# Altium schematic sheet LEDS.SchDoc
size A4; SheetNumber: 3; SheetTotal: 10; SPICEModelCacheAGKUTXAB: <root> / <DocumentId>AGKUTXAB</DocumentId> / <CacheFrame Number="0"> / <Model Name="0603_150060as75000" Kind="CKT"> / <Text>************************************************** / * Manufacturer:           WÃ¼rth Elektronik / * Kinds:                  SMT Mono-color Chip LED Waterclear / * Matchcode:              WL-SMCW / * Library Type:           LTspice / * Version:                rev24a / * Created/modified by:    Ella / * Date and Time:          2024-08-23 / * Team:                   eiSos EDA Service / * Contact:                libraries@we-online.com / ************************************************** / * Copyright(C) 2024 WÃ¼rth Elektronik eiSos GmbH &amp; Co. KG / * All Rights Reserved. / ************************************************** / * Disclaimer: While WÃ¼rth Elektronik eiSos has made every reasonable effort to ensure the accuracy / * of the simulation models provided, WÃ¼rth Elektronik eiSos does not guarantee the exemption of error on / * the simulation models, nor does WÃ¼rth Elektronik eiSos guarantee that the simulation model is current. / * WÃ¼rth Elektronik eiSos reserves the right to make any adjustments at any time without notice. / * WÃ¼rth Elektronik eiSos expressly disclaims all implied warranties regarding this simulation model. / ************************************************** / .subckt 0603_150060AS75000  1  2 / D1 1 2 SMCW / .MODEL SMCW D / + IS=10.010E-21 / + N=1.8643 / + RS=1.0000E-6 / + IKF=999 / + CJO=1.0000E-12 / + M=.3333 / + VJ=.75 / + BV=100 / + TT=5.0000E-9 / .ends</Text> / </Model> / </CacheFrame> / </root>
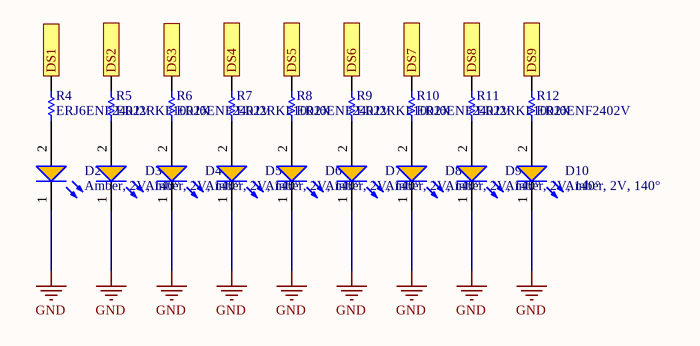
[diagram p0: LEDS.SchDoc]

## Parts
D2  Amber, 2V, 140°  [WL-SMCW_0603_150060xx75000]
D3  Amber, 2V, 140°  [WL-SMCW_0603_150060xx75000]
D4  Amber, 2V, 140°  [WL-SMCW_0603_150060xx75000]
D5  Amber, 2V, 140°  [WL-SMCW_0603_150060xx75000]
D6  Amber, 2V, 140°  [WL-SMCW_0603_150060xx75000]
D7  Amber, 2V, 140°  [WL-SMCW_0603_150060xx75000]
D8  Amber, 2V, 140°  [WL-SMCW_0603_150060xx75000]
D9  Amber, 2V, 140°  [WL-SMCW_0603_150060xx75000]
D10  Amber, 2V, 140°  [WL-SMCW_0603_150060xx75000]
R4  ERJ6ENF2402V  [RESC2013X70X40ML20T20]
R5  ERJ2RKF1002X  [RESC1005X40X25LL05T05]
R6  ERJ6ENF2402V  [RESC2013X70X40ML20T20]
R7  ERJ2RKF1002X  [RESC1005X40X25LL05T05]
R8  ERJ6ENF2402V  [RESC2013X70X40ML20T20]
R9  ERJ2RKF1002X  [RESC1005X40X25LL05T05]
R10  ERJ6ENF2402V  [RESC2013X70X40ML20T20]
R11  ERJ2RKF1002X  [RESC1005X40X25LL05T05]
R12  ERJ6ENF2402V  [RESC2013X70X40ML20T20]

## Ports
DS1 (see GlobalcircuitSchDoc[3A], Microcontroller[3B], On_Off_Switches[2A]), DS2 (see GlobalcircuitSchDoc[3A], Microcontroller[3B], On_Off_Switches[2A]), DS3 (see GlobalcircuitSchDoc[3A], Microcontroller[3B], On_Off_Switches[3A]), DS4 (see GlobalcircuitSchDoc[3A], Microcontroller[3B], On_Off_Switches[4A]), DS5 (see GlobalcircuitSchDoc[3A], Microcontroller[3B], On_Off_Switches[4A]), DS6 (see GlobalcircuitSchDoc[3A], Microcontroller[3B], On_Off_Switches[3B]), DS7 (see GlobalcircuitSchDoc[3A], Microcontroller[3B], On_Off_Switches[4B]), DS8 (see GlobalcircuitSchDoc[3B], Microcontroller[3C], On_Off_Switches[4B]), DS9 (see GlobalcircuitSchDoc[3B], Microcontroller[1B], On_Off_Switches[4C])

## Nets
GND: D2.1(K) D3.1(K) D4.1(K) D5.1(K) D6.1(K) D7.1(K) D8.1(K) D9.1(K) D10.1(K)
DS1: R4.2 ; port DS1
DS2: R5.1 ; port DS2
DS3: R6.2 ; port DS3
DS4: R7.1 ; port DS4
DS5: R8.2 ; port DS5
DS6: R9.1 ; port DS6
DS7: R10.2 ; port DS7
DS8: R11.1 ; port DS8
DS9: R12.2 ; port DS9
NetD2_2: D2.2(A) R4.1
NetD3_2: D3.2(A) R5.2
NetD4_2: D4.2(A) R6.1
NetD5_2: D5.2(A) R7.2
NetD6_2: D6.2(A) R8.1
NetD7_2: D7.2(A) R9.2
NetD8_2: D8.2(A) R10.1
NetD9_2: D9.2(A) R11.2
NetD10_2: D10.2(A) R12.1

## Library data of the parts
D2-D10 = 150060AS75000: WL-SMCW Mono-color Chip LED Waterclear, SMT, size 0603, Amber, 2V, 140°; Manufacturer: Wurth Elektronik; Case/Size Code: 0603; Chip Technology: AlInGaP; Dominant Wavelength: 605nm; Luminous Intensity: 130mcd; Peak Wavelength: 610nm; Manufacturer Part Number: 150060AS75000; Category: Signal LEDs; Match Code: WL-SMCW; ComponentLink1Description: Website Link; ComponentLink1URL: https://www.we-online.com/redexpert/article/150060AS75000?ad; ComponentLink2Description: Datasheet Link; ComponentLink2URL: https://www.we-online.com/redexpert/spec/150060AS75000?ad; Mount: Surface Mount; Operating Temperature Max: 85°C; Operating Temperature Min: -40°C; Packaging: Tape and Reel; Length: 1.6mm; Width: 0.8mm; Height: 0.7mm; Emitting Color: Amber; Forward Voltage: 2V; Viewing Angle: 140°
R4 R6 R8 R10 R12 = CMP-2001-00525-1: Manufacturer: Panasonic; Part Number: ERJ6ENF2402V
R5 R7 R9 R11 = CMP-2000-07588-1: Chip Resistor, 10 KOhm, +/- 1%, 0.1 W, -55 to 155 degC, 0402 (1005 Metric), RoHS, Tape and Reel; Manufacturer: Panasonic; Power Rating: 100mW; Voltage Rating: 50V; Resistance: 10KOhm; Case\/Package: 0402; Temperature Coefficient: 100ppm\/degreesC; RoHSCompliant: True; Lead Free: LeadFree; Package Quantity: 1; Contact Plating: Tin; Length: 1mm; Radiation Hardening: No; REACH SVHC: NoSVHC; Max Operating Temperature: 155degC; Depth: 0.5mm; Case Code (Imperial): 0402; Military Standard: Not; Package Description: 2-Pin Surface Mount Device, Body 1 x 0.5 mm; Termination: SMD/SMT; Case Code (Metric): 1005; Height: 0.35mm; Packaging: TapeandReel; Voltage Rating (DC): 50V; Package Reference: 402; Number of Pins: 2; Tolerance: 1%; Mounting Technology: SurfaceMount; Width: 0.02inch; Mount: SurfaceMount; Datasheet URL: https://industrial.panasonic.com/cdbs/www-data/pdf/RDA0000/AOA0000C304.pdf; Composition: ThickFilm; Datasheet Version: 02/2017; Manufacturer URL: http://www.panasonic.com/; Max Power Dissipation: 100mW; Number of Terminations: 2; Min Operating Temperature: -55degC